# EAGLE design esp32_wroom_32_pwm (EAGLE 9.2.2)
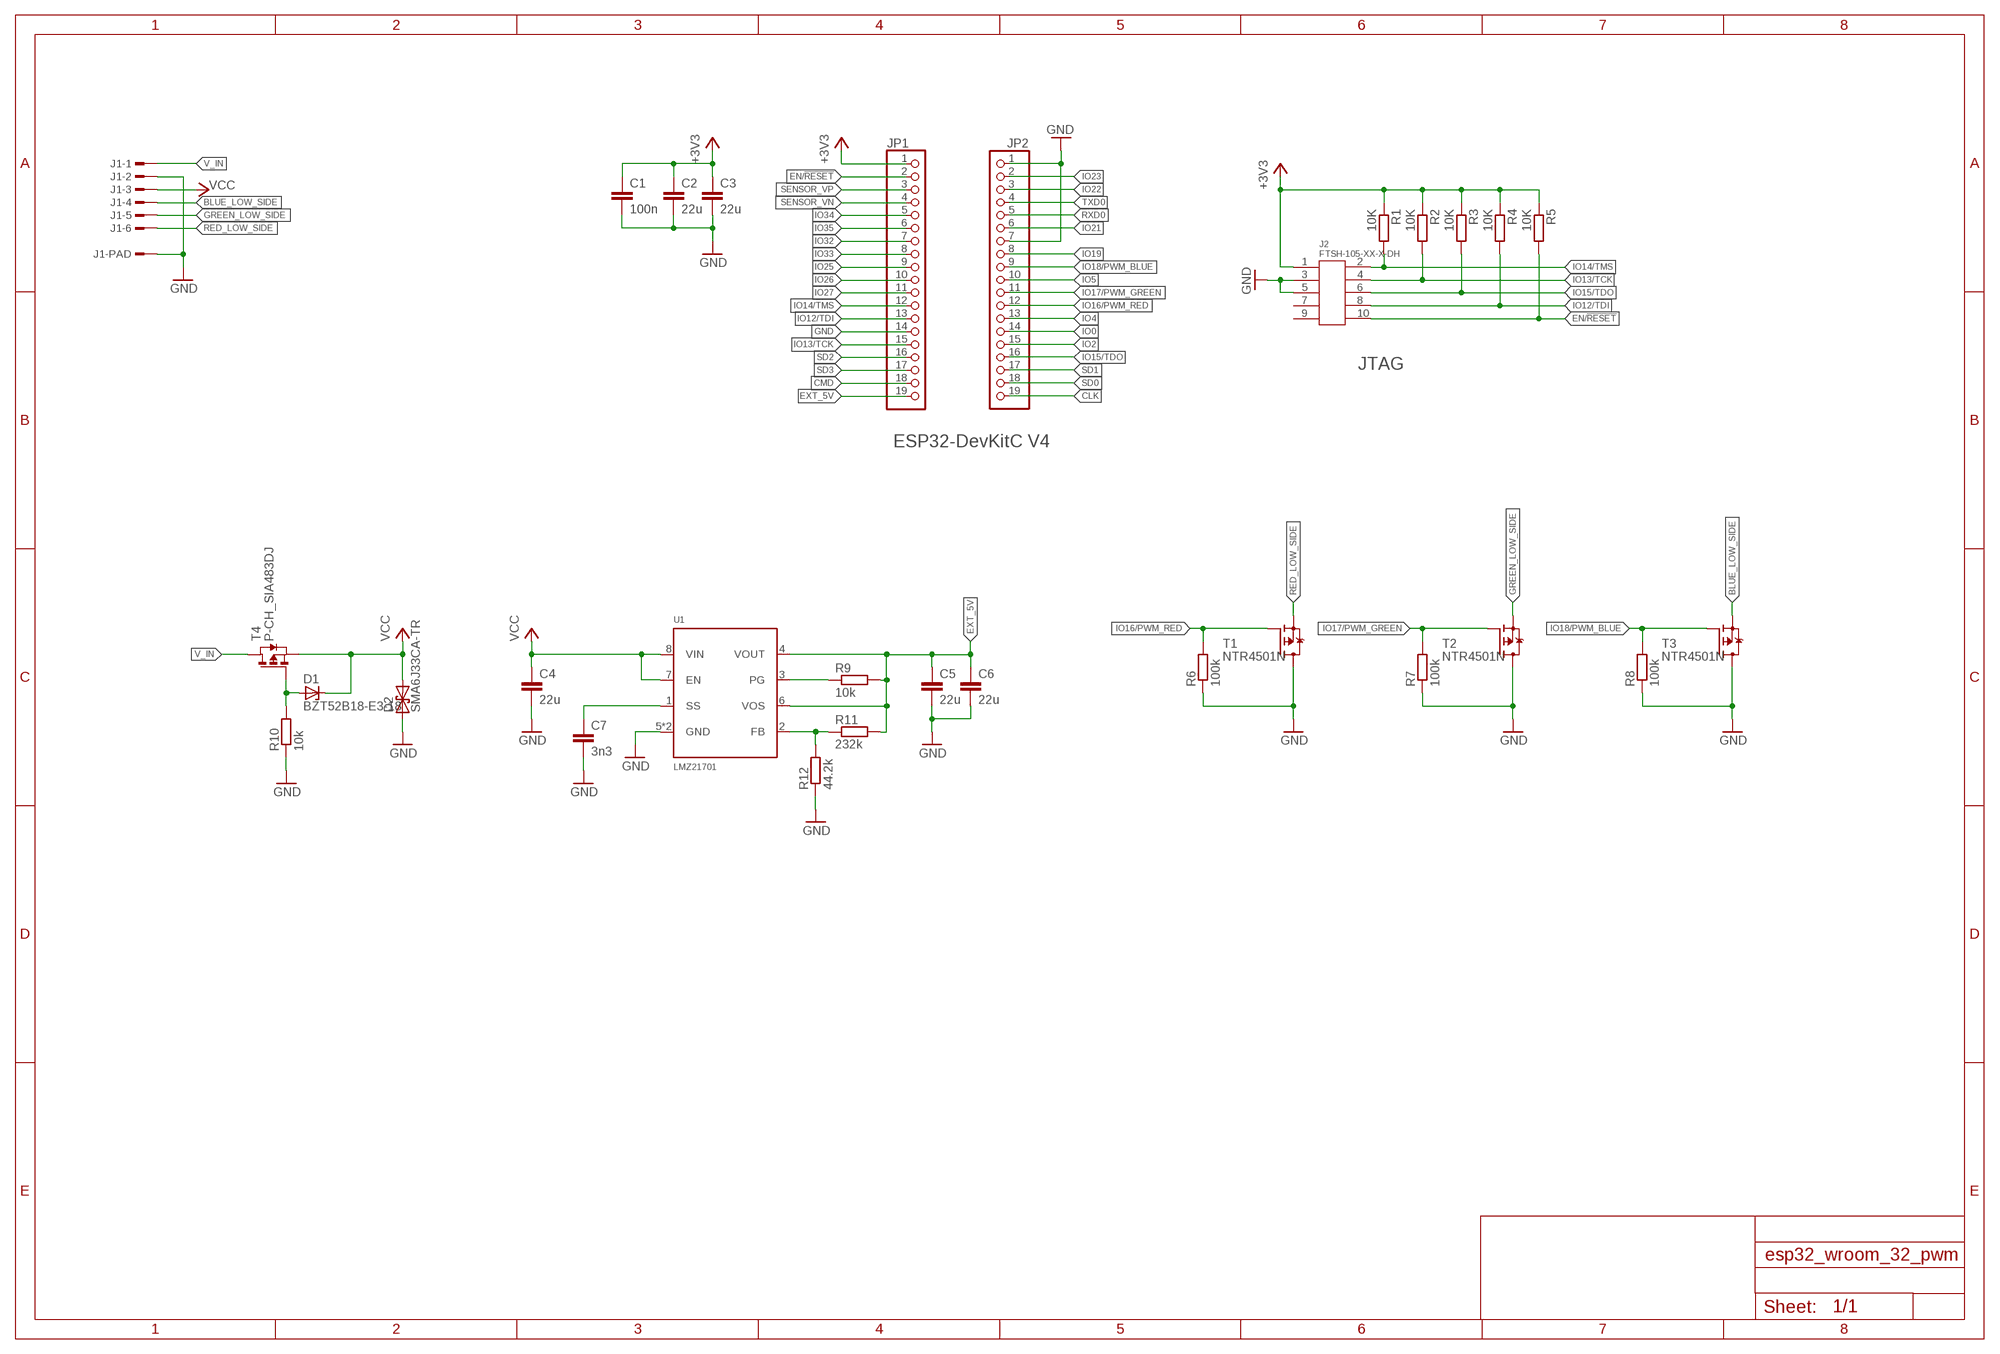
[diagram p0: schematic, sheet 1]

## Parts
C1  100n  C-EUC0603  [C0603]
C2  22u  C-EUC1210  [C1210]
C3  22u  C-EUC1210  [C1210]
C4  22u  C-EUC1210  [C1210]
C5  22u  C-EUC1210  [C1210]
C6  22u  C-EUC1210  [C1210]
C7  3n3  C-EUC0603  [C0603]
D1  BZT52B18-E3-18  ZENER_BZT52B18-E3-18  [SOD123F]
D2  SMA6J33CA-TR  [DO214AC]
J1  292227-6  [292227-6]
J2  FTSH-105-XX-X-DH  [FTSH-105-XX-XXX-DH]
JP1  PINHD-1X19  [1X19]
JP2  PINHD-1X19  [1X19]
R1  10K  R-EU_R0603  [R0603]
R2  10K  R-EU_R0603  [R0603]
R3  10K  R-EU_R0603  [R0603]
R4  10K  R-EU_R0603  [R0603]
R5  10K  R-EU_R0603  [R0603]
R6  100k  R-EU_R0603  [R0603]
R7  100k  R-EU_R0603  [R0603]
R8  100k  R-EU_R0603  [R0603]
R9  10k  R-EU_R0603  [R0603]
R10  10k  R-EU_R0603  [R0603]
R11  232k  R-EU_R0603  [R0603]
R12  44.2k  R-EU_R0603  [R0603]
T1  NTR4501N  [SOT23]
T2  NTR4501N  [SOT23]
T3  NTR4501N  [SOT23]
T4  P-CH_SIA483DJ  [POWERPAK_SC70-6L]
U1  LMZ21701  [SIL0008E]

## Nets
+3V3: C1.1 C2.1 C3.1 J2.1 JP1.1 R1.1 R2.1 R3.1 R4.1 R5.1
BLUE_LOW_SIDE: J1.4 T3.2(S)
CLK: JP2.19
CMD: JP1.18
EN/!RESET: J2.10 JP1.2 R5.2
EXT_5V: C5.1 C6.1 JP1.19 R9.2 R11.2 U1.4(VOUT) U1.6(VOS)
GND: C1.2 C2.2 C3.2 C4.2 C5.2 C6.2 C7.2 D2.A J1.2 J1.PAD1 J1.PAD2 J2.3 J2.5 JP1.14 JP2.1 JP2.7 R6.1 R7.1 R8.1 R10.1 R12.1 T1.3(D) T2.3(D) T3.3(D) U1.5(GND) U1.PAD(GND)
GREEN_LOW_SIDE: J1.5 T2.2(S)
IO0: JP2.14
IO2: JP2.15
IO4: JP2.13
IO5: JP2.10
IO12/TDI: J2.8 JP1.13 R4.2
IO13/TCK: J2.4 JP1.15 R2.2
IO14/TMS: J2.2 JP1.12 R1.2
IO15/TDO: J2.6 JP2.16 R3.2
IO16/PWM_RED: JP2.12 R6.2 T1.1(G)
IO17/PWM_GREEN: JP2.11 R7.2 T2.1(G)
IO18/PWM_BLUE: JP2.9 R8.2 T3.1(G)
IO19: JP2.8
IO21: JP2.6
IO22: JP2.3
IO23: JP2.2
IO25: JP1.9
IO26: JP1.10
IO27: JP1.11
IO32: JP1.7
IO33: JP1.8
IO34: JP1.5
IO35: JP1.6
LMZ_FB: R11.1 R12.2 U1.2(FB)
LMZ_PG: R9.1 U1.3(PG)
LMZ_SS: C7.1 U1.1(SS)
N$14: D1.A R10.2 T4.3(G)
RED_LOW_SIDE: J1.6 T1.2(S)
RXD0: JP2.5
SD0: JP2.18
SD1: JP2.17
SD2: JP1.16
SD3: JP1.17
SENSOR_VN: JP1.4
SENSOR_VP: JP1.3
TXD0: JP2.4
V_IN: J1.1 T4.1(D) T4.2(D) T4.5(D) T4.6(D) T4.TH_D(D)
VCC: C4.1 D1.C D2.C J1.3 T4.4(S) T4.TH_S(S) U1.7(EN) U1.8(VIN)
Unconnected: J2.7 J2.9

## Notes on the sheet
- JTAG
- ESP32-DevKitC V4

## Library data of the parts
C1-C7 = rcl:C-EU: CAPACITOR, European symbol; SPICEPREFIX: C
D1 = diode:ZENER_BZT52B18-E3-18; DISTRIBUTOR: Mouser; OC_MOUSER: 78-BZT52B18-E3-18; ORDER_CODE: 78-BZT52B18-E3-18
D2 = diode:SMA6J33CA-TR; DISTRIBUTOR: Mouser; OC_MOUSER: 511-SMA6J33CA-TR; ORDER_CODE: 511-SMA6J33CA-TR
J1 = te:292227-6: 1.5mm AMP Mini CT Connectors; DISTRIBUTOR: Digikey; OC_DIGIKEY: A98699CT-ND; ORDER_CODE: A98699CT-ND
J2 = samtec:FTSH-105-XX-X-
JP1 JP2 = pinhead:PINHD-1X19: PIN HEADER
R1-R5 R10 = rcl:R-EU_: RESISTOR, European symbol; DISTRIBUTOR: Mouser; OC_MOUSER: 71-CRCW0402-10K-E3; ORDER_CODE: 71-CRCW0402-10K-E3; SPICEPREFIX: R
R6-R8 R11 R12 = rcl:R-EU_: RESISTOR, European symbol; SPICEPREFIX: R
R9 = rcl:R-EU_: RESISTOR, European symbol; DISTRIBUTOR: Digikey; OC_DIGIKEY: P390AGCT-ND; ORDER_CODE: P390AGCT-ND; SPICEPREFIX: R
T1-T3 = fet:NTR4501N: 20 V, 3.2 A, Single N−Channel, SOT−23
T4 = fet:P-CH_SIA483DJ: P-Channel 12 V (D-S) MOSFET low Rds_on; DISTRIBUTOR: Digikey; OC_DIGIKEY: SIA483DJ-T1-GE3CT-ND
U1 = ti:LMZ2170*: LMZ2170X 1 A SIMPLE SWITCHER® Nano Module with 17 V Maximum Input Voltage; DISTRIBUTOR: RS; ORDER_CODE: 798-1212

## Board
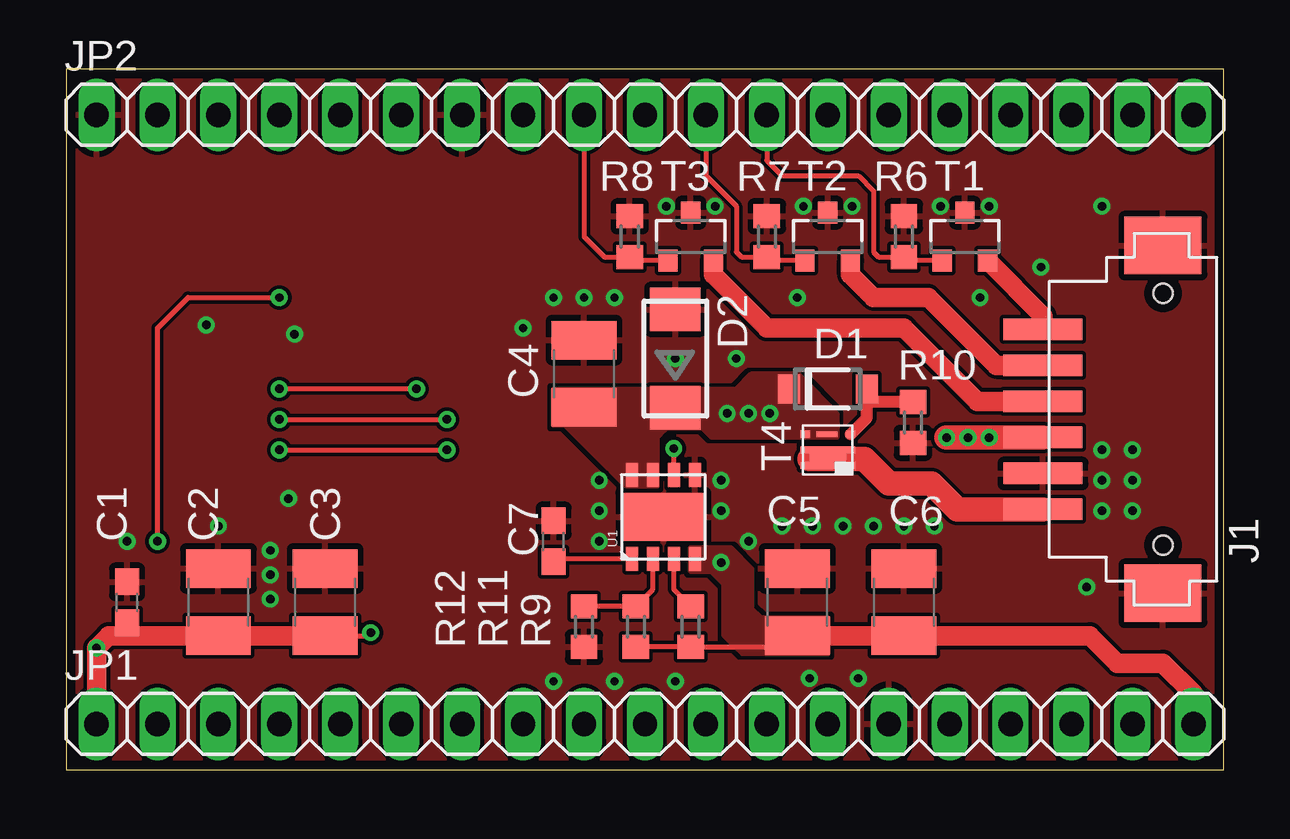
[diagram p1: board, top side]
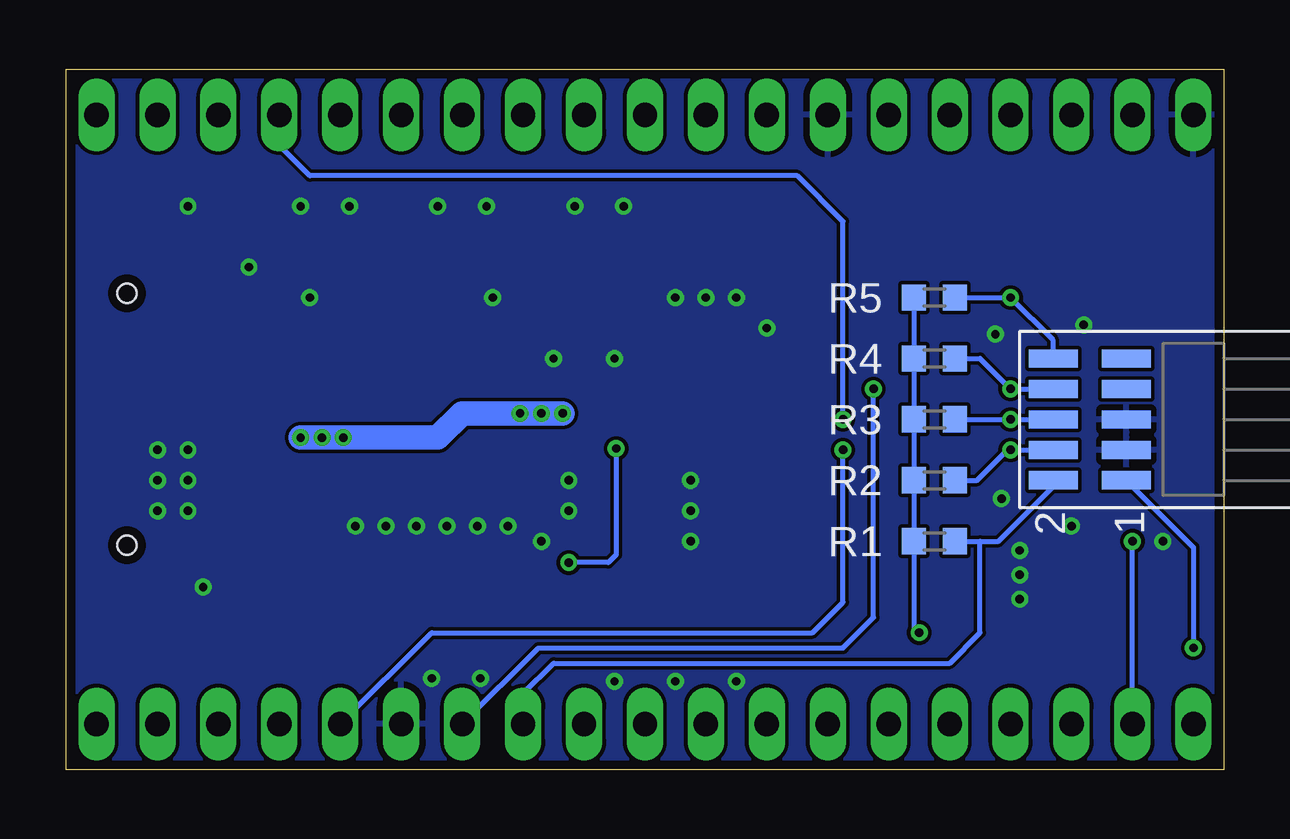
[diagram p2: board, bottom side, seen from below]

Size 48.26 x 29.21 mm. Coordinates in mm from the lower left corner, seen from the top.
Outline: 0,0 48.26,0 48.26,29.21 0,29.21 0,0
Copper layers (1*16): Top 0.0356mm / dielectric 1.5011mm / Bottom 0.0356mm
Design rules "oshPark2Layer": minimum track width 6mil, minimum drill 13mil, track to track 6mil, track to pad 6mil, pad to pad 6mil, via to via 6mil, smd to smd 6mil, copper to edge 15mil, drill to drill 6mil, minimum pad ring 7mil, minimum via ring 7mil, stop-mask expansion 3mil, vias tented up to drill 50mil, thermal gap 10mil

### Footprints (pad centres in the part's own frame; a part is rotated, then mirrored left to right if it is on the bottom)
C0603 = smd 1.1 x 1: 1 -0.85,0; 2 0.85,0
C1210 = smd 1.6 x 2.7: 1 -1.4,0; 2 1.4,0
SOD123F = smd 0.91 x 1.22: A 1.625,0; C -1.625,0
DO214AC = smd 1.8 x 2.1: A 2.05,0; C -2.05,0
292227-6 = smd 0.9 x 3.3: 1 -3.75,5; 2 -2.25,5; 3 -0.75,5; 4 0.75,5; 5 2.25,5; 6 3.75,5 | smd 2.4 x 3.2: PAD1 -7.25,0; PAD2 7.25,0 | hole 0.8: 5.25,0; -5.25,0
FTSH-105-XX-XXX-DH = smd 0.762 x 2.032: 1 2.54,-2.794; 2 2.54,-5.842; 3 1.27,-2.794; 4 1.27,-5.842; 5 0,-2.794; 6 0,-5.842; 7 -1.27,-2.794; 8 -1.27,-5.842; 9 -2.54,-2.794; 10 -2.54,-5.842
1X19 = drill 1.016 long: 1 -22.86,0; 2 -20.32,0; 3 -17.78,0; 4 -15.24,0; 5 -12.7,0; 6 -10.16,0; 7 -7.62,0; 8 -5.08,0; 9 -2.54,0; 10 0,0; 11 2.54,0; 12 5.08,0; 13 7.62,0; 14 10.16,0; 15 12.7,0; 16 15.24,0; 17 17.78,0; 18 20.32,0; 19 22.86,0
R0603 = smd 1 x 1.1: 1 -0.85,0; 2 0.85,0
SOT23 = smd 0.8 x 0.9: 1 -0.95,-1; 2 0.95,-1; 3 0,1
POWERPAK_SC70-6L = smd 0.3 x 0.39: 1 -0.65,-0.945; 2 0,-0.945; 3 0.65,-0.945; 4 0.65,0.945; 5 0,0.945; 6 -0.65,0.945 | smd 0.95 x 1.5: TH_D -0.325,0 | smd 0.235 x 0.87: TH_S 0.65,0.04
SIL0008E = smd 1 x 0.5: 1 -1.75,1.312; 2 -1.75,0.438; 3 -1.75,-0.438; 4 -1.75,-1.312; 5 1.75,-1.312; 6 1.75,-0.438; 7 1.75,0.438; 8 1.75,1.312 | smd 2 x 3.5: PAD 0,0

### Placement (x,y rotation side)
C1  2.54,6.99 90 top
C2  6.35,6.99 90 top
C3  10.79,6.99 90 top
C4  21.59,16.51 90 top
C5  30.48,6.99 90 top
C6  34.92,6.99 90 top
C7  20.32,9.53 90 top
D1  31.75,15.88 0 top
D2  25.4,17.14 90 top
J1  45.72,14.61 90 top
J2  1.27,14.61 270 bottom
JP1  24.13,1.91 0 top
JP2  24.13,27.3 0 top
R1  12.07,9.53 0 bottom
R2  12.07,12.06 0 bottom
R3  12.07,14.61 0 bottom
R4  12.07,17.14 0 bottom
R5  12.07,19.68 0 bottom
R6  34.92,22.22 270 top
R7  29.21,22.22 270 top
R8  23.5,22.22 270 top
R9  26.04,5.97 270 top
R10  35.31,14.48 90 top
R11  23.75,5.97 270 top
R12  21.59,5.97 90 top
T1  37.46,22.22 0 top
T2  31.75,22.22 0 top
T3  26.04,22.22 0 top
T4  31.75,13.34 90 top
U1  24.89,10.54 90 top

### Tracks (layer width: path | path; a pad name or v marks a point on that pad's centre or on a via)
+3V3  (via drill 0.35)
  Top 0.203: v12.7,5.71 12.57,5.58 C3.1 | C1.1 2.54,5.58
  Top 0.813: C3.1 C2.1 2.54,5.58 1.77,5.58 v1.27,5.08 JP1.1
  Bottom 0.203: R5.1 R4.1 R3.1 R2.1 R1.1 12.92,5.93 v12.7,5.71 | J2.1 1.27,9.27 v1.27,5.08
BLUE_LOW_SIDE
  Top 0.813: J1.4 37.98,15.36 34.92,18.41 29.21,18.41 26.98,20.64 T3.2
EN/!RESET  (via drill 0.35)
  Top 0.203: v8.89,19.68 5.08,19.68 3.81,18.41 v3.81,9.53
  Bottom 0.203: R5.2 v8.89,19.68 7.11,17.91 J2.10 | JP1.2 v3.81,9.53
EXT_5V  (via drill 0.35)
  Top 0.203: U1.6 v25.33,13.39 | R11.2 R9.2 30.01,5.12 C5.1
  Top 0.813: JP1.19 46.99,3.17 45.72,4.45 43.81,4.45 42.67,5.58 C6.1 C5.1
  Bottom 0.203: v25.33,13.39 25.33,8.96 25.65,8.64 v27.3,8.64
  pour Top (no thermals): 26.04,9.27 27.69,9.27 28.57,8.38 28.57,6.73 28.96,6.35 31.75,6.35 31.75,4.83 28.19,4.83 27.43,5.59 27.43,7.75 26.92,8.26 26.04,8.26
GND  (via drill 0.35)
  other vias: 2.54,9.53 32.77,23.49 30.73,23.49 36.45,23.49 25.02,23.49 27.05,23.49 38.48,23.49 22.23,9.53 22.23,10.79 22.23,12.06 28.45,9.53 27.3,10.79 27.3,12.06 33.65,10.16 29.84,10.16 31.11,10.16 34.92,10.16 36.2,10.16 32.38,10.16 33.02,3.81 22.86,19.68 21.59,19.68 20.32,19.68 19.05,18.41 25.4,17.14 27.94,17.14 30.48,19.68 38.1,19.68 43.18,23.49 40.64,20.95 42.54,7.62 43.18,12.06 43.18,13.34 43.18,10.79 44.45,10.79 44.45,12.06 44.45,13.34 22.86,3.68 25.4,3.68 20.32,3.68 30.99,3.81 8.51,9.14 8.51,8.13 8.51,7.11 6.35,10.16 9.53,18.16 5.84,18.54 9.27,11.3
  pour Top (rank 2): 49.53,-1.91 -1.27,-1.91 -1.27,31.11 49.53,31.11
  pour Bottom: 49.53,-1.91 -1.27,-1.91 -1.27,31.11 49.53,31.11
GREEN_LOW_SIDE
  Top 0.813: J1.5 38.77,16.85 35.94,19.68 33.65,19.68 32.7,20.64 T2.2
IO12/TDI  (via drill 0.35)
  Top 0.203: v14.61,15.88 v8.89,15.88
  Bottom 0.203: JP1.13 28.57,5.08 15.88,5.08 14.61,6.35 v14.61,15.88 | R4.2 10.16,17.14 v8.89,15.88 J2.8
IO13/TCK  (via drill 0.35)
  Top 0.203: v8.89,13.34 v15.88,13.34
  Bottom 0.203: JP1.15 33.02,5.71 17.14,5.71 15.88,6.99 v15.88,13.34 | J2.4 v8.89,13.34 9.02,13.34 10.29,12.06 R2.2
IO14/TMS
  Bottom 0.203: 10.16,9.53 9.4,9.53 7.11,11.81 J2.2 | JP1.12 29.21,3.17 27.94,4.45 11.43,4.45 10.16,5.71 10.16,9.53 | R1.2 10.16,9.53
IO15/TDO  (via drill 0.35)
  Top 0.203: v8.89,14.61 v15.88,14.61
  Bottom 0.203: R3.2 v8.89,14.61 J2.6 | v15.88,14.61 15.88,22.86 17.78,24.76 38.1,24.76 39.37,26.04 JP2.16
IO16/PWM_RED
  Top 0.203: JP2.12 29.21,25.4 29.84,24.76 33.02,24.76 33.65,24.13 33.65,21.59 33.87,21.38 R6.2 35.07,21.22 T1.1
IO17/PWM_GREEN
  Top 0.203: JP2.11 26.67,24.76 27.94,23.49 27.94,21.59 28.16,21.38 R7.2 29.36,21.22 T2.1
IO18/PWM_BLUE
  Top 0.203: JP2.9 21.59,22.22 22.44,21.38 R8.2 23.64,21.22 T3.1
LMZ_FB
  Top 0.203: U1.2 24.45,7.52 R11.1 R12.2
LMZ_PG
  Top 0.203: R9.1 25.33,7.52 U1.3
LMZ_SS
  Top 0.203: U1.1 20.44,8.79 C7.1
N$14
  Top 0.203: D1.A 33.41,15.84 33.41,15.33
  Top 0.508: T4.3 33.38,14.67 33.38,15.37 33.41,15.33 R10.2
RED_LOW_SIDE
  Top 0.813: T1.2 40.72,18.92 J1.6
V_IN
  Top 0.203: T4.TH_D 31.43,12.69 T4.6 30.99,12.87 30.99,12.95 30.81,13.14 T4.5 | 33.27,12.95 33,12.69 T4.1 T4.2
  Top 1.016: J1.1 37.15,10.86 36.07,11.94 34.29,11.94 33.27,12.95 30.99,12.95
VCC  (via drill 0.35)
  Top 1.016: v36.7,13.84 v37.59,13.84 v38.48,13.84 38.49,13.86 J1.3
  Bottom 1.016: v27.56,14.86 31.75,14.86 32.77,13.84 v38.48,13.84
  other vias: 29.34,14.86 28.45,14.86
  pour Top (no thermals): 32.13,13.84 26.92,13.84 26.54,14.22 25.02,14.22 24.77,13.97 24.64,13.84 24.64,11.81 23.37,11.81 20.83,14.35 20.32,14.35 20.32,15.88 27.94,15.88 28.57,16.51 30.48,16.51 30.61,16.38 32.13,14.86